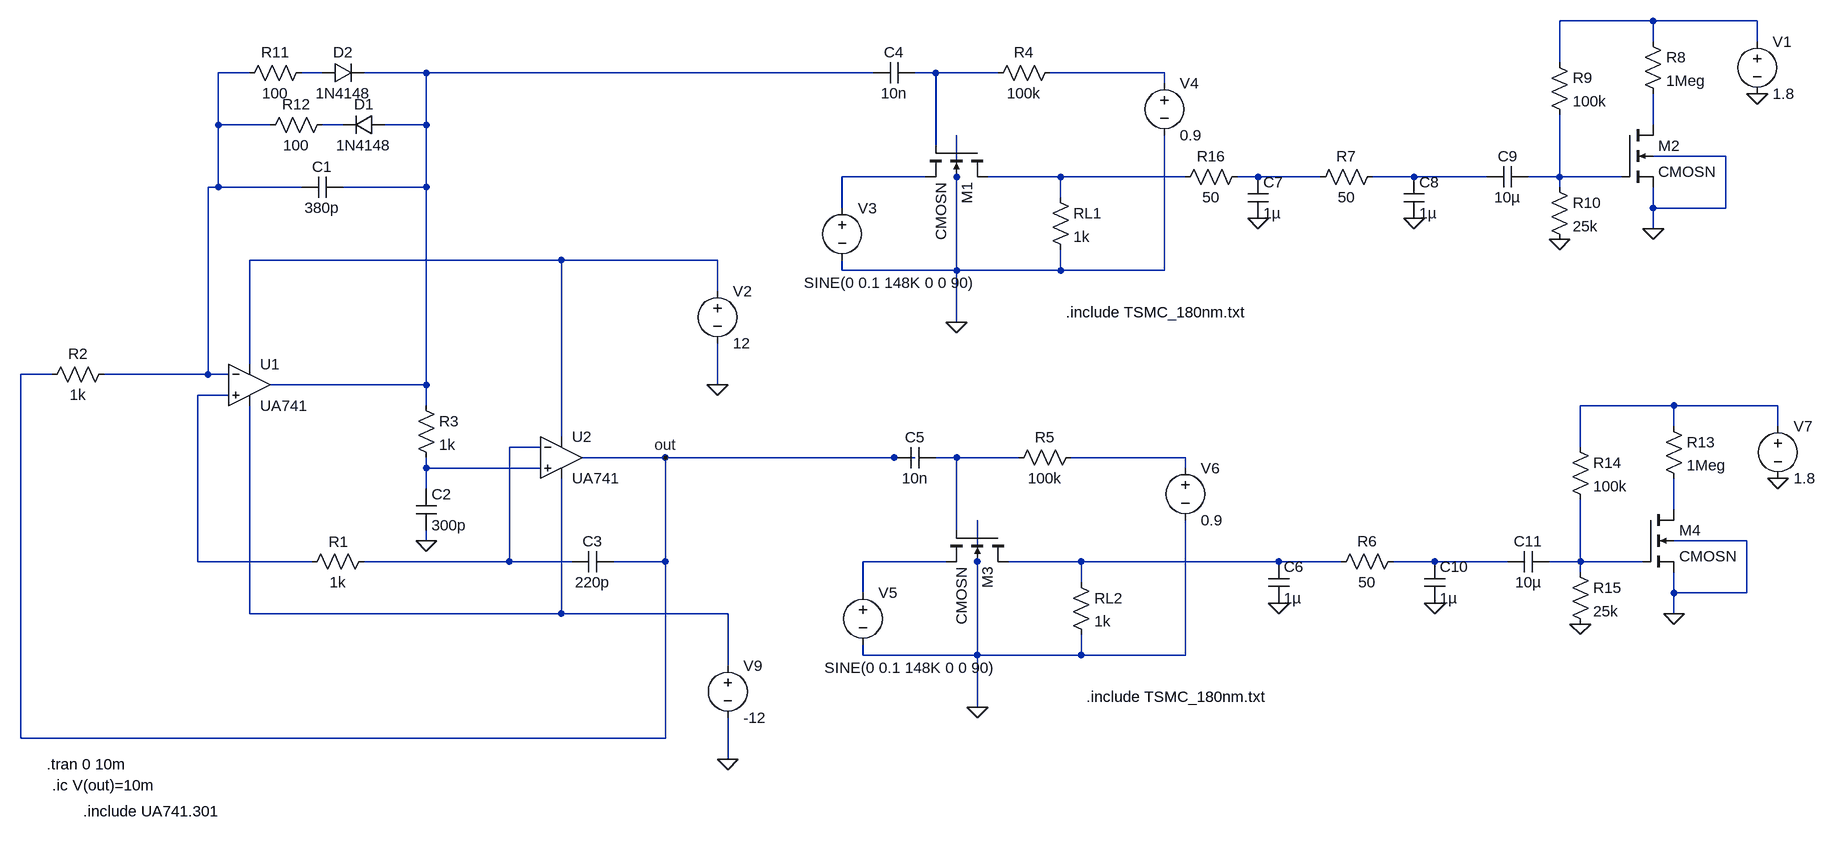
[diagram p0: schematic final.asc]
final.asc, the LTspice schematic file:
Version 4.1
SHEET 1 2384 1360
WIRE 2128 -400 1984 -400
WIRE 2288 -400 2128 -400
WIRE 2128 -368 2128 -400
WIRE 2288 -368 2288 -400
WIRE 1984 -336 1984 -400
WIRE -32 -320 -80 -320
WIRE 80 -320 48 -320
WIRE 240 -320 144 -320
WIRE 928 -320 240 -320
WIRE 1024 -320 992 -320
WIRE 1120 -320 1024 -320
WIRE 1376 -320 1200 -320
WIRE 1376 -304 1376 -320
WIRE -80 -240 -80 -320
WIRE 0 -240 -80 -240
WIRE 112 -240 80 -240
WIRE 240 -240 240 -320
WIRE 240 -240 176 -240
WIRE 2128 -240 2128 -288
WIRE 1024 -208 1024 -320
WIRE 2240 -192 2128 -192
WIRE 1008 -160 880 -160
WIRE 1056 -160 1056 -224
WIRE 1216 -160 1104 -160
WIRE 1408 -160 1216 -160
WIRE 1520 -160 1488 -160
WIRE 1616 -160 1520 -160
WIRE 1760 -160 1696 -160
WIRE 1872 -160 1760 -160
WIRE 1984 -160 1984 -256
WIRE 1984 -160 1936 -160
WIRE 2080 -160 1984 -160
WIRE -80 -144 -80 -240
WIRE -80 -144 -96 -144
WIRE 48 -144 -80 -144
WIRE 240 -144 240 -240
WIRE 240 -144 112 -144
WIRE 1984 -144 1984 -160
WIRE 1216 -128 1216 -160
WIRE 880 -112 880 -160
WIRE 2128 -112 2128 -144
WIRE 2240 -112 2240 -192
WIRE 2240 -112 2128 -112
WIRE 2128 -80 2128 -112
WIRE 448 -32 -32 -32
WIRE 688 -32 448 -32
WIRE 880 -16 880 -32
WIRE 1056 -16 1056 -160
WIRE 1056 -16 880 -16
WIRE 1216 -16 1216 -48
WIRE 1216 -16 1056 -16
WIRE 1376 -16 1376 -224
WIRE 1376 -16 1216 -16
WIRE 688 16 688 -32
WIRE 1056 64 1056 -16
WIRE -32 128 -32 -32
WIRE -336 144 -384 144
WIRE -96 144 -96 -144
WIRE -96 144 -256 144
WIRE -64 144 -96 144
WIRE 240 160 240 -144
WIRE 240 160 0 160
WIRE 688 160 688 96
WIRE -64 176 -112 176
WIRE 240 192 240 160
WIRE 2160 192 2016 192
WIRE 2320 192 2160 192
WIRE 2160 224 2160 192
WIRE 2320 224 2320 192
WIRE 448 240 448 -32
WIRE 416 256 368 256
WIRE 2016 256 2016 192
WIRE 608 272 480 272
WIRE 960 272 608 272
WIRE 992 272 960 272
WIRE 1056 272 1024 272
WIRE 1152 272 1056 272
WIRE 1408 272 1232 272
WIRE 240 288 240 272
WIRE 416 288 240 288
WIRE 1408 288 1408 272
WIRE 240 320 240 288
WIRE 2160 352 2160 304
WIRE 1056 384 1056 272
WIRE 240 400 240 384
WIRE 2272 400 2160 400
WIRE -112 432 -112 176
WIRE 64 432 -112 432
WIRE 368 432 368 256
WIRE 368 432 144 432
WIRE 464 432 368 432
WIRE 608 432 608 272
WIRE 608 432 528 432
WIRE 1040 432 912 432
WIRE 1088 432 1088 368
WIRE 1248 432 1136 432
WIRE 1552 432 1248 432
WIRE 1648 432 1552 432
WIRE 1792 432 1728 432
WIRE 1904 432 1792 432
WIRE 2016 432 2016 336
WIRE 2016 432 1968 432
WIRE 2112 432 2016 432
WIRE 2016 448 2016 432
WIRE 1248 464 1248 432
WIRE 912 480 912 432
WIRE 2160 480 2160 448
WIRE 2272 480 2272 400
WIRE 2272 480 2160 480
WIRE -32 512 -32 192
WIRE 448 512 448 304
WIRE 448 512 -32 512
WIRE 704 512 448 512
WIRE 2160 512 2160 480
WIRE 912 576 912 560
WIRE 1088 576 1088 432
WIRE 1088 576 912 576
WIRE 1248 576 1248 544
WIRE 1248 576 1088 576
WIRE 1408 576 1408 368
WIRE 1408 576 1248 576
WIRE 704 592 704 512
WIRE 1088 656 1088 576
WIRE -384 704 -384 144
WIRE 608 704 608 432
WIRE 608 704 -384 704
WIRE 704 736 704 672
FLAG 1056 64 0
FLAG 240 400 0
FLAG 688 160 0
FLAG 704 736 0
FLAG 608 272 out
FLAG 1520 -96 0
FLAG 1760 -96 0
FLAG 2288 -288 0
FLAG 2128 -80 0
FLAG 1984 -64 0
FLAG 1088 656 0
FLAG 1552 496 0
FLAG 1792 496 0
FLAG 2320 304 0
FLAG 2160 512 0
FLAG 2016 528 0
SYMBOL cap 992 -336 R90
WINDOW 0 0 32 VBottom 2
WINDOW 3 32 32 VTop 2
SYMATTR InstName C4
SYMATTR Value 10n
SYMBOL res 1216 -336 R90
WINDOW 0 0 56 VBottom 2
WINDOW 3 32 56 VTop 2
SYMATTR InstName R4
SYMATTR Value 100k
SYMBOL nmos4 1104 -208 R90
SYMATTR InstName M1
SYMATTR Value CMOSN
SYMATTR Value2 l=0.18u w=1.8u ad=0.81u as=0.81u pd=4.5u ps=4.5u m=1
SYMBOL res 1200 -144 R0
SYMATTR InstName RL1
SYMATTR Value 1k
SYMBOL voltage 880 -128 R0
WINDOW 123 0 0 Left 0
WINDOW 39 0 0 Left 0
WINDOW 3 -59 131 Left 2
SYMATTR Value SINE(0 0.1 148K 0 0 90)
SYMATTR InstName V3
SYMBOL voltage 1376 -320 R0
SYMATTR InstName V4
SYMATTR Value 0.9
SYMBOL cap 112 -160 R90
WINDOW 0 0 32 VBottom 2
WINDOW 3 32 32 VTop 2
SYMATTR InstName C1
SYMATTR Value 380p
SYMBOL res 160 416 R90
WINDOW 0 1 55 VBottom 2
WINDOW 3 32 56 VTop 2
SYMATTR InstName R1
SYMATTR Value 1k
SYMBOL res -240 128 R90
WINDOW 0 0 56 VBottom 2
WINDOW 3 32 56 VTop 2
SYMATTR InstName R2
SYMATTR Value 1k
SYMBOL res 224 176 R0
SYMATTR InstName R3
SYMATTR Value 1k
SYMBOL cap 224 320 R0
SYMATTR InstName C2
SYMATTR Value 300p
SYMBOL cap 528 416 R90
WINDOW 0 0 32 VBottom 2
WINDOW 3 32 32 VTop 2
SYMATTR InstName C3
SYMATTR Value 220p
SYMBOL voltage 688 0 R0
WINDOW 123 0 0 Left 0
WINDOW 39 0 0 Left 0
SYMATTR InstName V2
SYMATTR Value 12
SYMBOL voltage 704 576 R0
WINDOW 123 0 0 Left 0
WINDOW 39 0 0 Left 0
SYMATTR InstName V9
SYMATTR Value -12
SYMBOL OpAmps\\opamp2 -32 96 R0
SYMATTR InstName U1
SYMATTR Value UA741
SYMBOL OpAmps\\opamp2 448 208 R0
SYMATTR InstName U2
SYMATTR Value UA741
SYMBOL res 64 -336 R90
WINDOW 0 0 56 VBottom 2
WINDOW 3 32 56 VTop 2
SYMATTR InstName R11
SYMATTR Value 100
SYMBOL diode 176 -256 R90
WINDOW 0 0 32 VBottom 2
WINDOW 3 32 32 VTop 2
SYMATTR InstName D1
SYMATTR Value 1N4148
SYMBOL diode 80 -304 R270
WINDOW 0 32 32 VTop 2
WINDOW 3 0 32 VBottom 2
SYMATTR InstName D2
SYMATTR Value 1N4148
SYMBOL res 96 -256 R90
WINDOW 0 0 56 VBottom 2
WINDOW 3 32 56 VTop 2
SYMATTR InstName R12
SYMATTR Value 100
SYMBOL cap 1504 -160 R0
SYMATTR InstName C7
SYMATTR Value 1µ
SYMBOL res 1712 -176 R90
WINDOW 0 0 56 VBottom 2
WINDOW 3 32 56 VTop 2
SYMATTR InstName R7
SYMATTR Value 50
SYMBOL cap 1744 -160 R0
SYMATTR InstName C8
SYMATTR Value 1µ
SYMBOL nmos4 2080 -240 R0
SYMATTR InstName M2
SYMATTR Value2 l=0.18u w=18u ad=8.1p as=8.1p pd=36.9u ps=36.9u m=1
SYMATTR Value CMOSN
SYMBOL res 2112 -384 R0
SYMATTR InstName R8
SYMATTR Value 1Meg
SYMBOL voltage 2288 -384 R0
SYMATTR InstName V1
SYMATTR Value 1.8
SYMBOL res 1968 -352 R0
SYMATTR InstName R9
SYMATTR Value 100k
SYMBOL res 1968 -160 R0
SYMATTR InstName R10
SYMATTR Value 25k
SYMBOL cap 1936 -176 R90
WINDOW 0 0 32 VBottom 2
WINDOW 3 32 32 VTop 2
SYMATTR InstName C9
SYMATTR Value 10µ
SYMBOL cap 1024 256 R90
WINDOW 0 0 32 VBottom 2
WINDOW 3 32 32 VTop 2
SYMATTR InstName C5
SYMATTR Value 10n
SYMBOL res 1248 256 R90
WINDOW 0 0 56 VBottom 2
WINDOW 3 32 56 VTop 2
SYMATTR InstName R5
SYMATTR Value 100k
SYMBOL nmos4 1136 384 R90
SYMATTR InstName M3
SYMATTR Value CMOSN
SYMATTR Value2 l=0.18u w=1.8u ad=0.81u as=0.81u pd=4.5u ps=4.5u m=1
SYMBOL res 1232 448 R0
SYMATTR InstName RL2
SYMATTR Value 1k
SYMBOL voltage 912 464 R0
WINDOW 123 0 0 Left 0
WINDOW 39 0 0 Left 0
WINDOW 3 -59 131 Left 2
SYMATTR Value SINE(0 0.1 148K 0 0 90)
SYMATTR InstName V5
SYMBOL voltage 1408 272 R0
SYMATTR InstName V6
SYMATTR Value 0.9
SYMBOL cap 1536 432 R0
SYMATTR InstName C6
SYMATTR Value 1µ
SYMBOL res 1744 416 R90
WINDOW 0 0 56 VBottom 2
WINDOW 3 32 56 VTop 2
SYMATTR InstName R6
SYMATTR Value 50
SYMBOL cap 1776 432 R0
SYMATTR InstName C10
SYMATTR Value 1µ
SYMBOL nmos4 2112 352 R0
SYMATTR InstName M4
SYMATTR Value2 l=0.18u w=18u ad=8.1p as=8.1p pd=36.9u ps=36.9u m=1
SYMATTR Value CMOSN
SYMBOL res 2144 208 R0
SYMATTR InstName R13
SYMATTR Value 1Meg
SYMBOL voltage 2320 208 R0
SYMATTR InstName V7
SYMATTR Value 1.8
SYMBOL res 2000 240 R0
SYMATTR InstName R14
SYMATTR Value 100k
SYMBOL res 2000 432 R0
SYMATTR InstName R15
SYMATTR Value 25k
SYMBOL cap 1968 416 R90
WINDOW 0 0 32 VBottom 2
WINDOW 3 32 32 VTop 2
SYMATTR InstName C11
SYMATTR Value 10µ
SYMBOL res 1504 -176 R90
WINDOW 0 0 56 VBottom 2
WINDOW 3 32 56 VTop 2
SYMATTR InstName R16
SYMATTR Value 50
TEXT 1224 48 Left 2 !.include TSMC_180nm.txt
TEXT -344 744 Left 2 !.tran 0 10m
TEXT -336 776 Left 2 !.ic V(out)=10m
TEXT -288 816 Left 2 !.include UA741.301
TEXT 1256 640 Left 2 !.include TSMC_180nm.txt

The netlist it stands for:
* final.asc
C4 N005 N004 10n
R4 N006 N005 100k
M1 N010 N005 N009 0 CMOSN l=0.18u w=1.8u ad=0.81u as=0.81u pd=4.5u ps=4.5u m=1
RL1 N010 0 1k
V3 N009 0 SINE(0 0.1 148K 0 0 90)
V4 N006 0 0.9
C1 N004 N002 380p
R1 N017 N015 1k
R2 N002 out 1k
R3 N004 N020 1k
C2 N020 0 300p
C3 out N017 220p
V2 N014 0 12
V9 N026 0 -12
X§U1 N015 N002 N014 N026 N004 UA741  ; pins In+ In- V+ V- OUT
X§U2 N020 N017 N014 N026 out UA741  ; pins In+ In- V+ V- OUT
R11 N003 N002 100
D1 N004 N007 1N4148
D2 N003 N004 1N4148
R12 N007 N002 100
C7 N011 0 1µ
R7 N012 N011 50
C8 N012 0 1µ
M2 N008 N013 0 0 CMOSN l=0.18u w=18u ad=8.1p as=8.1p pd=36.9u ps=36.9u m=1
R8 N001 N008 1Meg
V1 N001 0 1.8
R9 N001 N013 100k
R10 N013 0 25k
C9 N013 N012 10µ
C5 N018 out 10n
R5 N019 N018 100k
M3 N023 N018 N022 0 CMOSN l=0.18u w=1.8u ad=0.81u as=0.81u pd=4.5u ps=4.5u m=1
RL2 N023 0 1k
V5 N022 0 SINE(0 0.1 148K 0 0 90)
V6 N019 0 0.9
C6 N023 0 1µ
R6 N024 N023 50
C10 N024 0 1µ
M4 N021 N025 0 0 CMOSN l=0.18u w=18u ad=8.1p as=8.1p pd=36.9u ps=36.9u m=1
R13 N016 N021 1Meg
V7 N016 0 1.8
R14 N016 N025 100k
R15 N025 0 25k
C11 N025 N024 10µ
R16 N011 N010 50
.model D D
.lib standard.dio
.model NMOS NMOS
.model PMOS PMOS
.lib standard.mos
.include TSMC_180nm.txt
.tran 0 10m
.ic V(out)=10m
.include UA741.301
.include TSMC_180nm.txt
.backanno
.end